# Altium schematic sheet STM32_USB.SchDoc
size A4
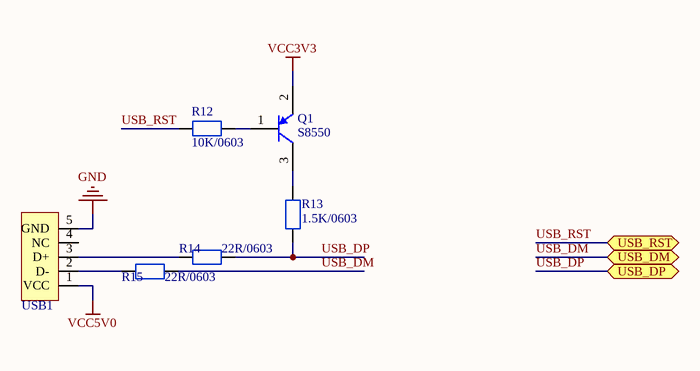
[diagram p0: STM32_USB.SchDoc]

## Parts
Q1  S8550  [SOT-23]
R12  10K/0603  [R0603]
R13  1.5K/0603  [R0603]
R14  22R/0603  [R0603]
R15  22R/0603  [R0603]
USB1  USB-Mini  [USB-Mini]  (value not drawn)

## Ports
USB_DM, USB_DP, USB_RST

## Nets
GND: USB1.5(GND)
VCC3V3: Q1.2(E)
VCC5V0: USB1.1(VCC)
USB_DM: R15.2 ; port USB_DM
USB_DP: R13.1 R14.2 ; port USB_DP
USB_RST: R12.2 ; port USB_RST
NetQ1_1: Q1.1(B) R12.1
NetQ1_3: Q1.3(C) R13.2
NetR14_1: R14.1 USB1.3(D+)
NetR15_1: R15.1 USB1.2(D-)

Not connected (* = marked no-connect by the designer): USB1 4(NC)

## Library data of the parts
R12-R15 = RES